# EAGLE design TaaraNodeMini (EAGLE 7.2.0)
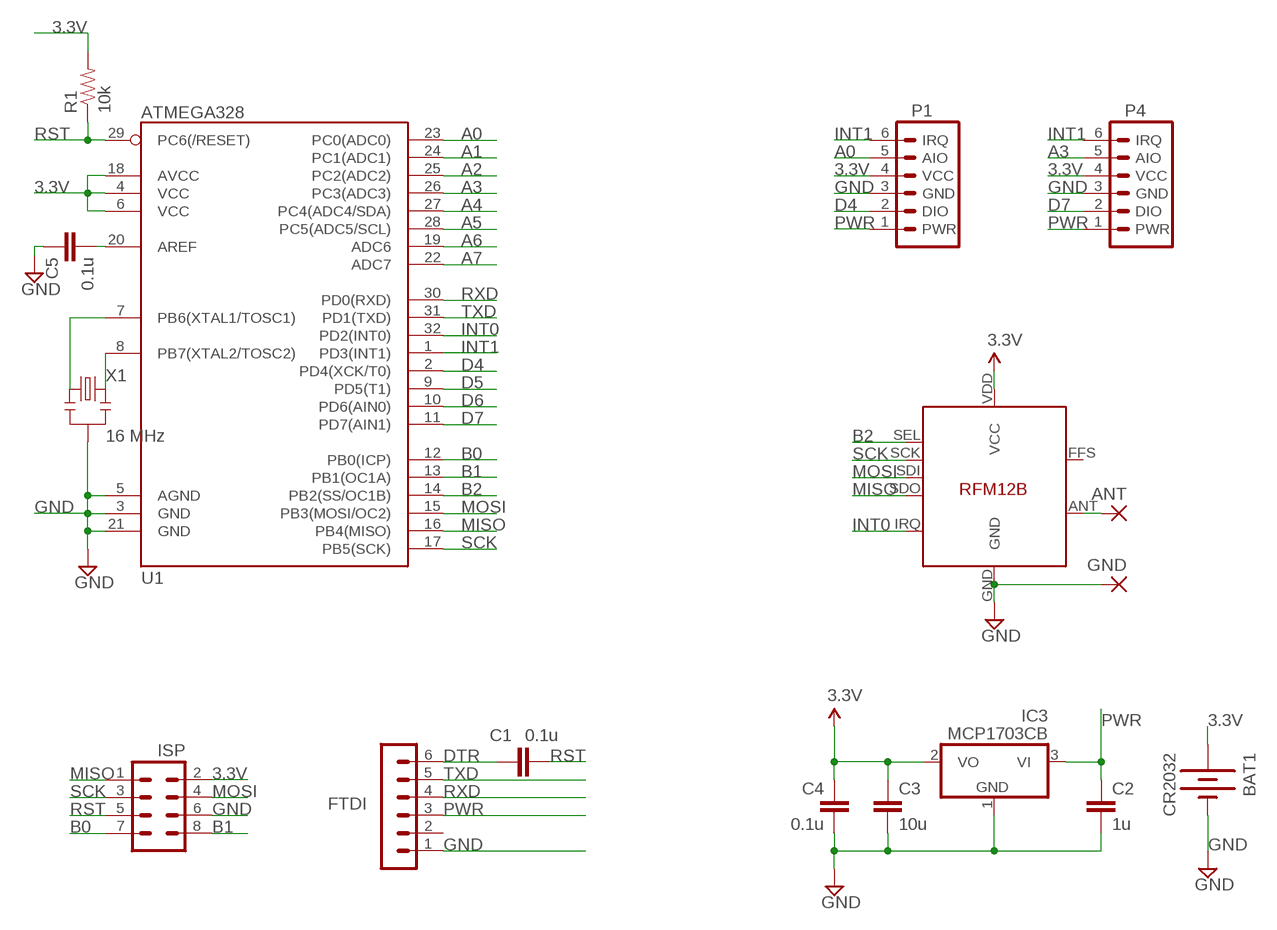
[diagram p0: schematic, sheet 1]

## Parts
ANT  1,6/0,8  [1,6/0,8]
BAT1  CR2032  BATTERY20PTH  [BATTCOM_20MM_PTH]
C1  0.1u  CAP0603-CAP  [0603-CAP]
C2  1u  CAP0603-CAP  [0603-CAP]
C3  10u  CAP0805  [0805]
C4  0.1u  CAP0603-CAP  [0603-CAP]
C5  0.1u  CAP0603-CAP  [0603-CAP]
FTDI  FTDI  MA06-1  [MA06-1]
GND  1,6/0,8  [1,6/0,8]
IC3  MCP1703CB  [SOT23]
P1  JEEPORT  JEEPORT-FEMALE  [1X06_FEMALE_LOCK.010]
P4  JEEPORT  JEEPORT-FEMALE  [1X06_FEMALE_LOCK.010]
R1  10k  RESISTOR0603-RES  [0603-RES]
SV7  ISP  MA04-2  [MA04-2]
U1  ATMEGA328  ATMEGA168  [TQFP32-08]
U$1  RFM12B  [RFM12B]
X1  16 MHz  RESONATORSMD  [RESONATOR-SMD]

## Nets
3.3V [power]: BAT1.1(+) C3.1 C4.1 IC3.2(VO) P1.4(VCC) P4.4(VCC) R1.2 SV7.2 U1.4(VCC) U1.6(VCC) U1.18(AVCC) U$1.VDD(VCC)
A0: P1.5(AIO) U1.23(PC0(ADC0))
A1: U1.24(PC1(ADC1))
A2: U1.25(PC2(ADC2))
A3: P4.5(AIO) U1.26(PC3(ADC3))
A4: U1.27(PC4(ADC4/SDA))
A5: U1.28(PC5(ADC5/SCL))
A6: U1.19(ADC6)
A7: U1.22(ADC7)
AREF: C5.2 U1.20(AREF)
B0: SV7.7 U1.12(PB0(ICP))
B1: SV7.8 U1.13(PB1(OC1A))
B2: U1.14(PB2(SS/OC1B)) U$1.SEL
D4: P1.2(DIO) U1.2(PD4(XCK/T0))
D5: U1.9(PD5(T1))
D6: U1.10(PD6(AIN0))
D7: P4.2(DIO) U1.11(PD7(AIN1))
DTR: C1.2 FTDI.6
GND [power]: BAT1.2(-) C2.2 C3.2 C4.2 C5.1 FTDI.1 GND.1(P) IC3.1(GND) P1.3(GND) P4.3(GND) SV7.6 U1.3(GND) U1.5(AGND) U1.21(GND) U$1.GND X1.2
INT0: U1.32(PD2(INT0)) U$1.IRQ
INT1: P1.6(IRQ) P4.6(IRQ) U1.1(PD3(INT1))
MISO: SV7.1 U1.16(PB4(MISO)) U$1.SDO
MOSI: SV7.4 U1.15(PB3(MOSI/OC2)) U$1.SDI
N$1: U1.7(PB6(XTAL1/TOSC1)) X1.1
N$18: ANT.1(P) U$1.ANT
N$21: U1.8(PB7(XTAL2/TOSC2)) X1.3
PWR [power]: C2.1 FTDI.3 IC3.3(VI) P1.1(PWR) P4.1(PWR)
RST: C1.1 R1.1 SV7.5 U1.29(PC6(/RESET))
RXD: FTDI.4 U1.30(PD0(RXD))
SCK: SV7.3 U1.17(PB5(SCK)) U$1.SCK
TXD: FTDI.5 U1.31(PD1(TXD))
Unconnected: FTDI.2 U$1.FFS

## Library data of the parts
ANT GND = wirepad:1,6/0,8: THROUGH-HOLE PAD
BAT1 = JeeLabs:BATTERY: Battery Holders Various common sizes : AA, AAA, 20mm coin cell and 12mm coin cell.
C1-C5 = SparkFun:CAP: Capacitor Standard 0603 ceramic capacitor, and 0.1" leaded capacitor.
FTDI = JeeLabs:MA06-1: PIN HEADER
IC3 = linear:MCP1703: 250 mA, 16V, Low Quiescent Current LDO Regulator Source: http://ww1.microchip.com/downloads/en/DeviceDoc/22049b.pdf
P1 P4 = JeeLabs:JEEPORT: PIN HEADER
R1 = SparkFun:RESISTOR: Resistor Basic schematic elements and footprints for 0603, 1206, and PTH 1/10th watt (small) resistors.
SV7 = JeeLabs:MA04-2: PIN HEADER
U1 = SparkFun:ATMEGA168
U$1 = JeeLabs:RFM12B
X1 = SparkFun:RESONATOR: Resonator Small SMD resonator. This is the itty bitty 10/20MHz resonators with built in caps. CSTCE10M0G55 and CSTCE20M0V53. Footprint has been reviewed closely but hasn't been tested yet.

## Net classes
0 default: width 0.203 mm, clearance 0.203 mm
1 power: width 0.381 mm, clearance 0.254 mm

## Board
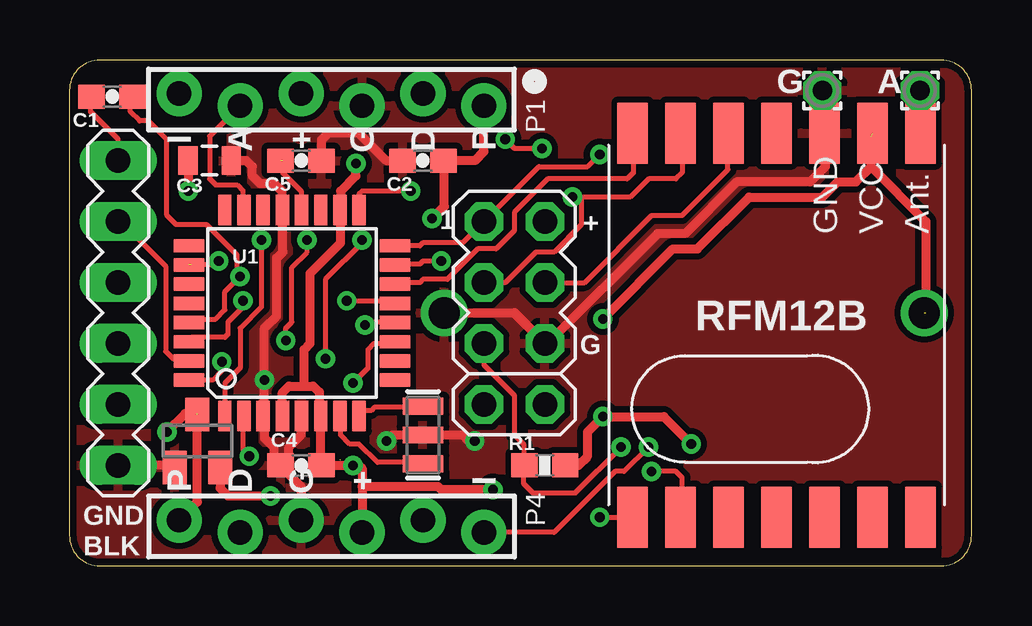
[diagram p1: board, top side]
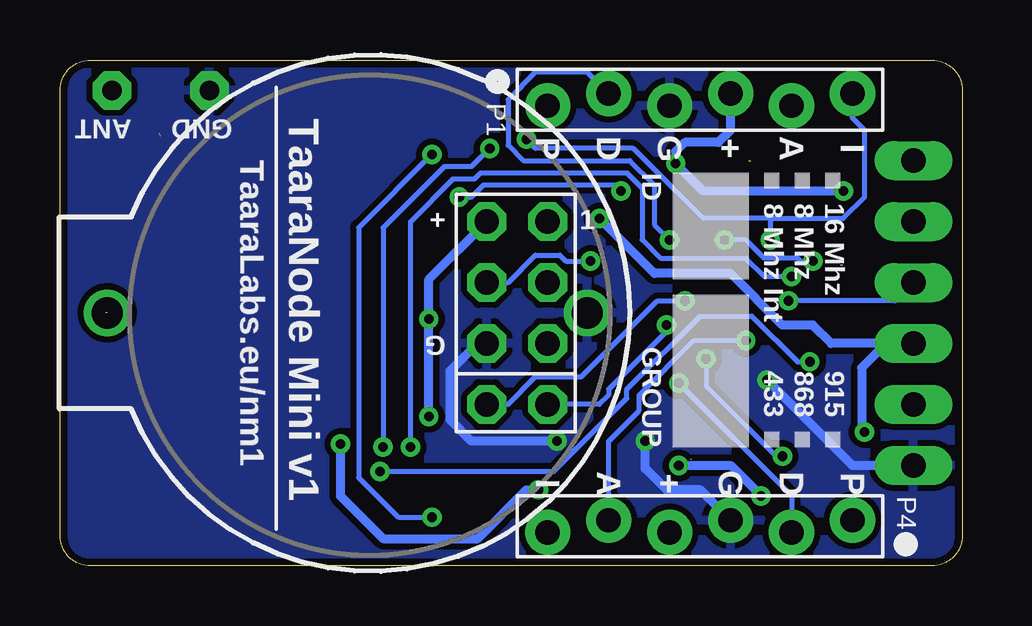
[diagram p2: board, bottom side, seen from below]

Size 37.59 x 21.08 mm. Coordinates in mm from the lower left corner, seen from the top.
Outline: 0,19.81 0,1.27 arc90 1.27,0 36.32,0 arc90 37.59,1.27 37.59,19.81 arc90 36.32,21.08 1.27,21.08 arc90 0,19.81
Copper layers (1*16): Top 0.035mm / dielectric 1.5mm / Bottom 0.035mm
Design rules: minimum track width 0.2mm, minimum drill 0.4mm, track to track 8mil, track to pad 8mil, pad to pad 8mil, via to via 8mil, smd to smd 8mil, copper to edge 12mil, drill to drill 0.4mm, minimum pad ring 0.3mm, minimum via ring 8mil, stop-mask expansion 4mil, vias tented up to drill 20mil, thermal gap 10mil

### Footprints (pad centres in the part's own frame; a part is rotated, then mirrored left to right if it is on the bottom)
1,6/0,8 = drill 0.813 pad 1.6 octagon: 1 0,0
BATTCOM_20MM_PTH = drill 1.3: 1 20,0; 2 0,0
0603-CAP = smd 1.1 x 1: 1 -0.85,0; 2 0.85,0
0805 = smd 0.8 x 1.2: 1 -0.9,0; 2 0.9,0
MA06-1 = drill 1.016 long: 1 0,0; 2 2.54,0; 3 5.08,0; 4 7.62,0; 5 10.16,0; 6 12.7,0
SOT23 = smd 1 x 1.4: 1 -0.95,-1.1; 2 0.95,-1.1; 3 0,1.1
1X06_FEMALE_LOCK.010 = drill 1.016 pad 1.88: 1 0,0.254; 2 2.54,-0.254; 3 5.08,0.254; 4 7.62,-0.254; 5 10.16,0.254; 6 12.7,-0.254
0603-RES = smd 1.1 x 1: 1 -0.85,0; 2 0.85,0
MA04-2 = drill 1.016 octagon: 1 -3.81,-1.27; 2 -3.81,1.27; 3 -1.27,-1.27; 4 -1.27,1.27; 5 1.27,-1.27; 6 1.27,1.27; 7 3.81,-1.27; 8 3.81,1.27
TQFP32-08 = smd 1.27 x 0.559: 1 -4.293,2.8; 2 -4.293,2; 3 -4.293,1.2; 4 -4.293,0.4; 5 -4.293,-0.4; 6 -4.293,-1.2; 7 -4.293,-2; 8 -4.293,-2.8; 17 4.293,-2.8; 18 4.293,-2; 19 4.293,-1.2; 20 4.293,-0.4; 21 4.293,0.4; 22 4.293,1.2; 23 4.293,2; 24 4.293,2.8 | smd 0.559 x 1.27: 9 -2.8,-4.293; 10 -2,-4.293; 11 -1.2,-4.293; 12 -0.4,-4.293; 13 0.4,-4.293; 14 1.2,-4.293; 15 2,-4.293; 16 2.8,-4.293; 25 2.8,4.293; 26 2,4.293; 27 1.2,4.293; 28 0.4,4.293; 29 -0.4,4.293; 30 -1.2,4.293; 31 -2,4.293; 32 -2.8,4.293
RFM12B = smd 2.54 x 1.27: ANT 8,-6; FFS -8,2; GND 8,-2; IRQ -8,4; P$8 -8,0; P$9 -8,-2; P$10 -8,-4; P$12 -8,-6; P$16 8,0; SCK 8,4; SDI 8,2; SDO -8,6; SEL 8,6; VDD 8,-4
RESONATOR-SMD = smd 0.7 x 1.7: 1 -1.2,0; 2 0,0; 3 1.2,0

### Placement (x,y rotation side)
ANT  35.43,19.81 0 top
BAT1  15.62,10.54 180 bottom
C1  1.78,19.56 180 top
C2  14.73,16.89 180 top
C3  5.84,16.89 0 top
C4  9.65,4.19 180 top
C5  9.65,16.89 180 top
FTDI  2.03,4.19 90 top
GND  31.37,19.81 0 top
IC3  5.33,5.21 0 top
P1  17.27,19.43 180 top
P4  4.57,1.65 0 top
R1  19.81,4.19 0 top
SV7  18.54,10.54 270 top
U1  9.27,10.54 90 top
U$1  29.46,10.03 90 top
U$2  [NODEPARAMS]  4.45,11.3 0 top
X1  14.73,5.46 90 top

### Tracks (layer width: path | path; a pad name or v marks a point on that pad's centre or on a via)
3.3V  (via drill 0.4)  (2 unrouted)
  Top 0.381: 12.19,3.3 12.19,4.06 12.06,4.19 v11.81,4.19 C4.1 10.47,4.22 U1.6 10.45,6.22 10.41,6.22 10.41,7.24 10.16,7.49 9.78,7.49 | 12.19,3.3 P4.4 | R1.2 21.21,4.19 21.59,4.57 21.59,5.59 v22.22,6.22 24.77,6.22 v25.91,5.08 | 33.4,16.64 33.4,17.91 | 33.4,16.64 32.77,16 32,16 31.37,15.37 28.32,15.37 26.16,13.21 25.15,13.21 v22.22,10.29 | 12.19,3.3 15.37,3.3 15.49,3.17 v17.65,3.17 | 9.78,7.49 9.78,9.02 10.03,9.27 10.03,12.19 11.3,13.46 11.3,14.99 | 33.4,16.64 35.69,14.35 35.69,10.54 | v11.94,16.76 11.94,16.26 11.3,15.62 11.3,14.99 | 11.3,14.99 U1.18 | U1.4 8.87,7.22 9.14,7.49 9.78,7.49 | IC3.2 6.28,3.24 6.6,2.92 v8.38,2.92 | C3.1 v4.95,15.62
  Bottom 0.381: v8.38,2.92 9.65,4.19 v11.81,4.19 | v17.65,3.17 18.16,3.17 20.19,1.14 24.13,1.14 25.91,2.92 v25.91,5.08 | v22.22,6.22 v22.22,10.29 22.22,11.94 SV7.2 | P1.4 9.65,18.16 10.16,17.65 11.56,17.65 11.94,17.27 v11.94,16.76 10.79,15.62 v4.95,15.62
3.3V1  (1 unrouted)
A0
  Top 0.203: P1.5 5.84,17.91 5.84,16.13 6.1,15.88 6.98,15.88 7.24,15.62 7.24,14.83 U1.23
A3  (via drill 0.4)  (1 unrouted)
  Top 0.203: v9.02,9.4 9.02,9.91 9.27,10.16 9.27,12.45 9.91,13.08 v9.91,13.59 | v6.22,12.7 6.06,12.54 5.08,12.54 5.08,12.57 | 5.08,12.7 U1.26
  Bottom 0.203: v6.22,12.7 6.73,12.7 6.86,12.83 8.25,12.83 9.02,13.59 v9.91,13.59 | v9.02,9.4 11.18,9.4 13.46,7.11 13.46,6.48 14.73,5.21 P4.5
AREF  (1 unrouted)
  Top 0.203: U1.20 9.67,15.6 8.89,16.38 8.89,16.89
B0  (via drill 0.4)
  Top 0.203: U1.12 13.59,10.16 12.45,10.16 v12.32,10.03
  Bottom 0.203: v12.32,10.03 12.32,9.78 14.73,7.37 14.73,7.11 15.11,6.73 SV7.7
B1  (via drill 0.4)
  Top 0.203: v11.56,11.05 13.59,11.05 U1.13
  Bottom 0.203: v11.56,11.05 12.7,11.05 15.88,7.87 17.78,7.87 18.92,6.73 SV7.8
B2
  Top 0.203: U$1.SEL 23.5,17.91 23.5,16.38 23.24,16.13 19.94,16.13 18.54,14.73 18.54,13.97 17.78,13.21 17.02,13.21 15.75,11.94 14.73,11.94 14.6,11.81 13.59,11.81 13.56,11.79 U1.14
D4  (via drill 0.4)
  Top 0.203: v10.67,8.64 10.67,11.94 12.19,13.46 v12.19,13.59 | U1.2 7.24,6.35 7.24,4.83 v7.49,4.57
  Bottom 0.203: v10.67,8.64 10.67,7.49 7.75,4.57 v7.49,4.57 | v12.19,13.59 12.83,14.22 12.83,15.88 13.84,16.89 18.29,16.89 18.92,17.53 18.92,19.43 17.78,20.57 15.62,20.57 P1.2
D7  (via drill 0.4)
  Top 0.203: 13.46,9.53 U1.11 13.49,9.27 12.7,9.27 12.45,9.02 12.45,8.26 v11.81,7.62
  Bottom 0.203: v11.81,7.62 7.11,2.92 P4.2
DTR
  Top 0.203: FTDI.6 2.03,17.78 0.89,18.92 0.89,19.47 C1.2
GND  (via drill 0.4)
  Top 0.381: 31.5,18.03 31.5,19.69 GND.1 | 31.5,17.91 31.5,16.64 30.86,16 27.81,16 25.65,13.84 24.51,13.84 19.94,9.27 SV7.6 | C2.2 13.21,16.89 12.06,18.03 | 12.06,19.05 12.06,18.03 | 9.65,6.27 9.65,5.46 9.14,4.95 9.14,4.19 C4.2 8.76,4.19 | v13.21,5.21 13.46,5.46 X1.2 16.38,5.46 16.64,5.21 v16.89,5.21 | 8.13,6.3 v8.13,7.75 8.13,9.91 8.64,10.41 8.64,12.83 8.89,13.08 8.89,14.85 | IC3.1 4.3,4.19 FTDI.1 | 8.13,6.3 8.13,5.33 8.51,4.95 8.51,4.19 8.76,4.19 | 8.76,4.19 9.65,3.3 P4.3 | 8.13,6.3 U1.3 | 9.65,6.35 9.65,6.27 | 9.65,6.27 U1.5 | U1.21 8.89,14.85 | BAT1.2 18.54,10.54 | 8.89,14.85 8.86,15.6 8.53,15.93 7.95,15.93 7.62,16.26 7.62,16.64 7.37,16.89 C3.2 | 12.06,18.03 10.79,18.03 10.5,17.74 C5.1
  Top 0.406: 18.54,10.54 SV7.6
  Bottom 0.381: v13.21,5.21 13.21,4.06 12.32,3.17 10.92,3.17 P4.3 | v8.13,7.75 4.57,4.19 FTDI.1 | SV7.6 20.19,9.27 21.34,8.13 21.34,6.1 20.45,5.21 v16.89,5.21
  pour Top: 1.27,0 36.32,0 arc90 37.59,1.27 37.59,19.94 arc90 36.45,21.08 1.14,21.08 arc90 0,19.94 0,1.02 arc90
  pour Bottom: 1.27,0 36.32,0 arc90 37.59,1.27 37.59,19.81 arc90 36.32,21.08 1.27,21.08 arc90 0,19.81 0,1.27 arc90
INT0  (via drill 0.4)
  Top 0.203: v6.35,8.51 6.35,8.13 5.97,7.75 4.95,7.75 U1.32 | v24.26,3.94 25.27,3.94 25.53,3.68 25.53,2.16 U$1.IRQ
  Bottom 0.203: v6.35,8.51 6.86,8.51 8.76,10.41 10.92,10.41 13.97,7.37 13.97,6.98 17.02,3.94 v24.26,3.94
INT1  (via drill 0.4)
  Top 0.203: v8,13.59 8,10.79 7.11,9.91 7.11,8.26 6.48,7.62 6.48,6.48 U1.1 | v19.68,17.4 18.54,17.4 v18.16,17.78 | v24.13,4.95 23.11,3.94 22.73,3.94 20.19,1.4 P4.6
  Bottom 0.203: 8,14.48 v8,13.59 | v24.13,4.95 24.13,14.1 21.59,16.64 20.45,16.64 v19.68,17.4 | v18.16,17.78 17.78,17.4 13.72,17.4 10.79,14.48 8,14.48 | P1.6 4.57,18.67 4.06,18.16 4.06,15.37 4.95,14.48 8,14.48
MISO  (via drill 0.4)
  Top 0.203: 13.59,13.46 U1.16 13.71,13.34 13.72,13.34 14.6,13.34 14.73,13.46 16.38,13.46 SV7.1 19.56,16.64 21.59,16.64 v22.1,17.14 | 23.5,2.92 23.5,2.16 U$1.SDO 23.5,2.03 v22.1,2.03
  Bottom 0.203: v22.1,2.03 23.5,2.03 25.15,3.68 25.15,14.1 v22.1,17.14
MOSI  (via drill 0.4)
  Top 0.203: 13.59,12.7 U1.15 13.68,12.54 13.72,12.57 14.6,12.57 14.73,12.7 v15.49,12.7 | SV7.4 21.46,11.81 24.26,14.61 25.53,14.61 27.43,16.51 27.43,17.91 U$1.SDI
  Bottom 0.203: v15.49,12.7 16.51,12.7 16.76,12.95 17.78,12.95 18.92,11.81 SV7.4
N$1
  Top 0.203: U1.7 11.3,6.35 11.3,5.46 11.68,5.08 12.06,5.08 12.83,4.32 14.73,4.32 X1.1
N$18
  Top 0.203: ANT.1 35.43,18.03 U$1.ANT
N$21
  Top 0.203: U1.8 12.19,6.48 12.57,6.48 12.7,6.6 14.73,6.6 X1.3
PWR  (via drill 0.4)  (1 unrouted)
  Top 0.381: 15.62,16.89 16.89,16.89 17.27,17.27 P1.1 | 15.62,16.89 C2.1 | v4.06,5.59 4.83,6.35 5.33,6.35 | v15.11,14.48 15.62,14.99 15.62,16.89 | P4.1 5.33,2.67 IC3.3
  Bottom 0.381: v15.11,14.48 12.83,12.19 9.65,12.19 7.49,10.03 6.22,10.03 5.46,9.27 3.17,9.27 | 3.17,9.27 4.19,8.26 4.19,5.71 v4.06,5.59 | 3.17,9.27 FTDI.3
RST  (via drill 0.4)
  Top 0.203: 6.98,12.07 6.98,11.94 6.48,11.43 6.48,10.67 6.1,10.29 5.08,10.29 U1.29 | 6.98,12.07 6.98,12.95 5.71,14.22 4.45,14.22 4.06,14.61 4.06,17.78 3.3,18.54 2.92,18.54 2.54,18.92 2.54,19.52 C1.1 | 18.92,4.19 R1.1 | SV7.5 17.27,8.38 18.54,7.11 18.54,5.46 18.92,5.08 18.92,4.19 | v7.11,12.07 6.98,12.07 | v22.99,4.95 21.08,3.05 19.3,3.05 18.92,3.43 18.92,4.19
  Bottom 0.203: v7.11,12.07 8.25,12.07 9.02,12.83 12.57,12.83 13.34,13.59 13.34,15.75 13.97,16.38 20.07,16.38 20.32,16.13 21.21,16.13 22.99,14.35 v22.99,4.95
RXD  (via drill 0.4)
  Top 0.203: v7.24,11.05 7.24,10.79 6.6,10.16 6.6,9.65 6.48,9.53 5.08,9.53 U1.30
  Bottom 0.203: v7.24,11.05 2.79,11.05 FTDI.4
SCK  (via drill 0.4)
  Top 0.203: v14.22,15.62 12.19,15.62 12.06,15.49 12.06,14.99 U1.17 | 21.34,15.37 v20.95,15.37 | 21.34,15.37 23.37,15.37 24.13,16.13 25.27,16.13 25.53,16.38 25.53,17.91 U$1.SCK | SV7.3 18.16,11.81 19.43,13.08 20.19,13.08 21.34,14.22 21.34,15.37
  Bottom 0.203: v14.22,15.62 14.48,15.88 19.94,15.88 20.45,15.37 v20.95,15.37
TXD
  Top 0.203: FTDI.5 2.16,14.35 4.01,12.5 4.01,8.94 4.32,8.64 4.95,8.64 U1.31

### Text on the board
_tsilk: G | A | I | A | + | G | D | P | P1 | 1 | + | RFM12B | G | P | D | G | + | I | GND | P4 | BLK
_bsilk: P1 | GND | ANT | I | A | + | G | D | P | + | 1 | TaaraNode Mini v1 | TaaraLabs.eu/nm1 | G | P4 | P | D | G | + | A | I